# Altium schematic sheet PAGE11.SchDoc
size 246 x 182 mm
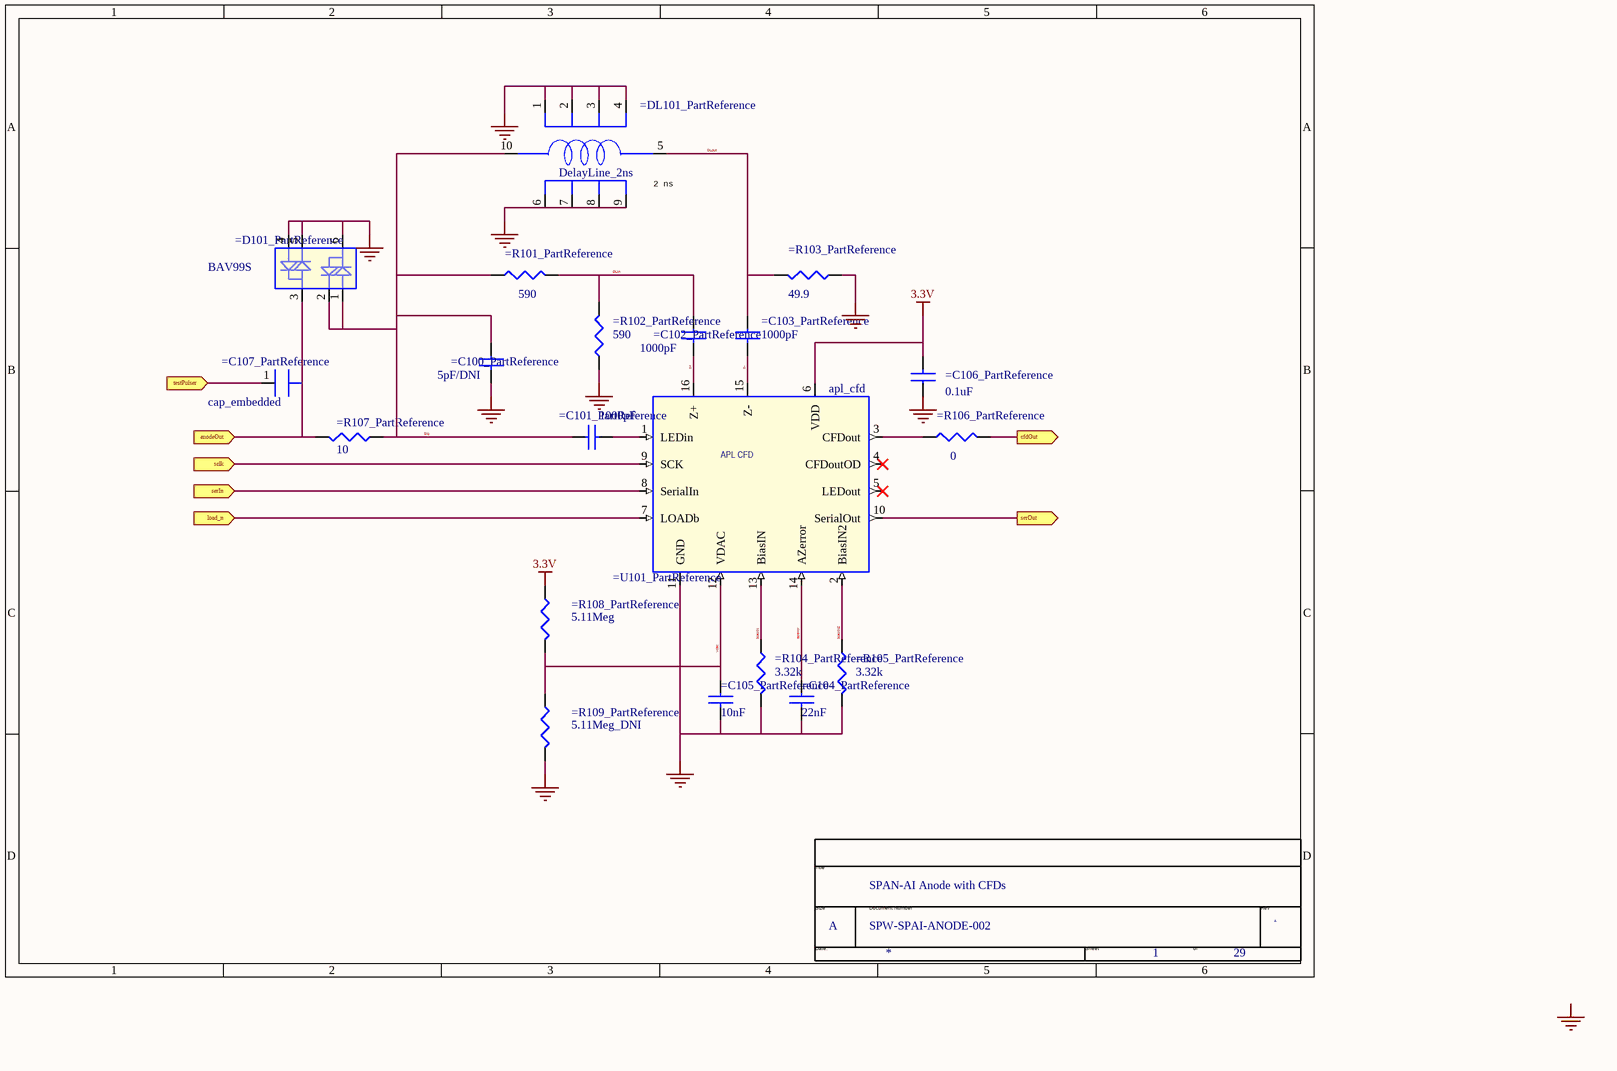
[diagram p0: PAGE11.SchDoc]

## Parts
*  Page Count: 29  Page Number: 1  Page Size: A  Title: SPAN-AI Anode with CFDs  Doc: SPW-SPAI-ANODE-002  (hidden comment: TitleBlock0)  (graphical)
=C100_PartReference  5pF/DNI  [0402]
=C101_PartReference  1000pF  [0402]
=C102_PartReference  1000pF  [0402]
=C103_PartReference  1000pF  [0402]
=C104_PartReference  22nF  [0603]
=C105_PartReference  10nF  [0603]
=C106_PartReference  0.1uF  [0805]
=C107_PartReference  cap_embedded  [cap_emb]
=D101_PartReference  BAV99S  [sot23]
=DL101_PartReference  DelayLine_2ns  [CDM10]
=R101_PartReference  590  [0402]
=R102_PartReference  590  [0402]
=R103_PartReference  49.9  [0402]
=R104_PartReference  3.32k  [0402]
=R105_PartReference  3.32k  [0402]
=R106_PartReference  0  [0402]
=R107_PartReference  10  [0402]
=R108_PartReference  5.11Meg  [0402]
=R109_PartReference  5.11Meg_DNI  [0402]
=U101_PartReference  apl_cfd  [lcc16]

## Ports
anodeOut (in), cfdOut (out), load_n (in), sclk (in), serIn (in), serOut (out), testPulser (in)

## Nets
3.3V: =C106_PartReference.2 =R108_PartReference.1 =U101_PartReference.6(VDD)
GND: =C100_PartReference.2 =C104_PartReference.2 =C105_PartReference.2 =C106_PartReference.1 =D101_PartReference.4 =D101_PartReference.5 =D101_PartReference.6 =DL101_PartReference.1(GND1) =DL101_PartReference.2(GND2) =DL101_PartReference.3(GND3) =DL101_PartReference.4(GND4) =DL101_PartReference.6(GND5) =DL101_PartReference.7(GND6) =DL101_PartReference.8(GND7) =DL101_PartReference.9(GND8) =R102_PartReference.1 =R103_PartReference.1 =R104_PartReference.2 =R105_PartReference.2 =R109_PartReference.2 =U101_PartReference.11(GND)
anodeOut: =D101_PartReference.3 =R107_PartReference.2 ; port anodeOut
azerror: =C104_PartReference.1 =U101_PartReference.14(AZerror)
biasIN: =R104_PartReference.1 =U101_PartReference.13(BiasIN)
biasIN2: =R105_PartReference.1 =U101_PartReference.2(BiasIN2)
cfdOut: =R106_PartReference.2 ; port cfdOut
DLin: =C102_PartReference.1 =R101_PartReference.2 =R102_PartReference.2
DLout: =C103_PartReference.1 =DL101_PartReference.5(OUT) =R103_PartReference.2
load_n: =U101_PartReference.7(LOADb) ; port load_n
sclk: =U101_PartReference.9(SCK) ; port sclk
serIn: =U101_PartReference.8(SerialIn) ; port serIn
serOut: =U101_PartReference.10(SerialOut) ; port serOut
Sig: =C100_PartReference.1 =C101_PartReference.1 =D101_PartReference.1 =D101_PartReference.2 =DL101_PartReference.10(IN) =R101_PartReference.1 =R107_PartReference.1
testPulser: =C107_PartReference.1 ; port testPulser
vdac: =C105_PartReference.1 =R108_PartReference.2 =R109_PartReference.1 =U101_PartReference.12(VDAC)
z+: =C102_PartReference.2 =U101_PartReference.16(Z+)
z-: =C103_PartReference.2 =U101_PartReference.15(Z-)
Net=C101_PartReference_2: =C101_PartReference.2 =U101_PartReference.1(LEDin)
Net=R106_PartReference_1: =R106_PartReference.1 =U101_PartReference.3(CFDout)

Not connected (* = marked no-connect by the designer): =U101_PartReference 4(CFDoutOD)* 5(LEDout)*

## Notes on the sheet
- (near =DL101_PartReference) 2 ns
- Labels drawn without touching a wire or pin: GND
- (in symbol apl_cfd_1) APL CFD
- (in symbol TitleBlock0) Title; Size; Document Number; Rev; Date:; Sheet; of

## Library data of the parts
=C100_PartReference = CAP NP_Dup2: PartNumber: SR0402NPO5R0B3; PCB Footprint: 0402
=C101_PartReference =C102_PartReference =C103_PartReference = CAP NP_Dup2: PartNumber: SR0402NPO102B3; PCB Footprint: 0402
=C104_PartReference = CAP NP_Dup2: PartNumber: SR0603X7R223K2NT95#M123; PCB Footprint: 0603
=C105_PartReference = CAP NP_Dup2: PartNumber: SR0603X7R103K2NT95#M123; PCB Footprint: 0603
=C106_PartReference = CAP NP_Dup2: PartNumber: SR0805X7R104K2NT95#M123; PCB Footprint: 0805
=D101_PartReference = dual_diode_0: PartNumber: BAV99S; PCB Footprint: BAV99S
=DL101_PartReference = DelayLine_1: PCB Footprint: CDM2005; PartNumber: CDM2005
=R101_PartReference =R102_PartReference = R_Dup1: PartNumber: M55342H11B590DR; PCB Footprint: 0402
=R103_PartReference = R_Dup1: PartNumber: M55342H11B49D9R; PCB Footprint: 0402
=R104_PartReference =R105_PartReference = R_Dup1: PartNumber: M55342H11B3E32R; PCB Footprint: 0402
=R106_PartReference = R_Dup1: PCB Footprint: 0402
=R107_PartReference = R_Dup1: PartNumber: M55342H11B10D0R; PCB Footprint: 0402
=R108_PartReference =R109_PartReference = R: Pin Numbers Visible: True; Pin Names Visible: False; EDIForiginalOrigin: (pt 0 0); EDIFviewName: NORMAL; PCB Footprint: 0402
=U101_PartReference = apl_cfd_1: PCB Footprint: apl_cfd
* = TitleBlock0: RevCode: A; Page Create Date: March  8, 1995; Page Modify Date: *; Page_Number: =TitleBlock_2_Page_Number
=C107_PartReference = cap_embedded: PCB Footprint: cap_emb